# EAGLE design frontpanel (EAGLE 9.6.2)
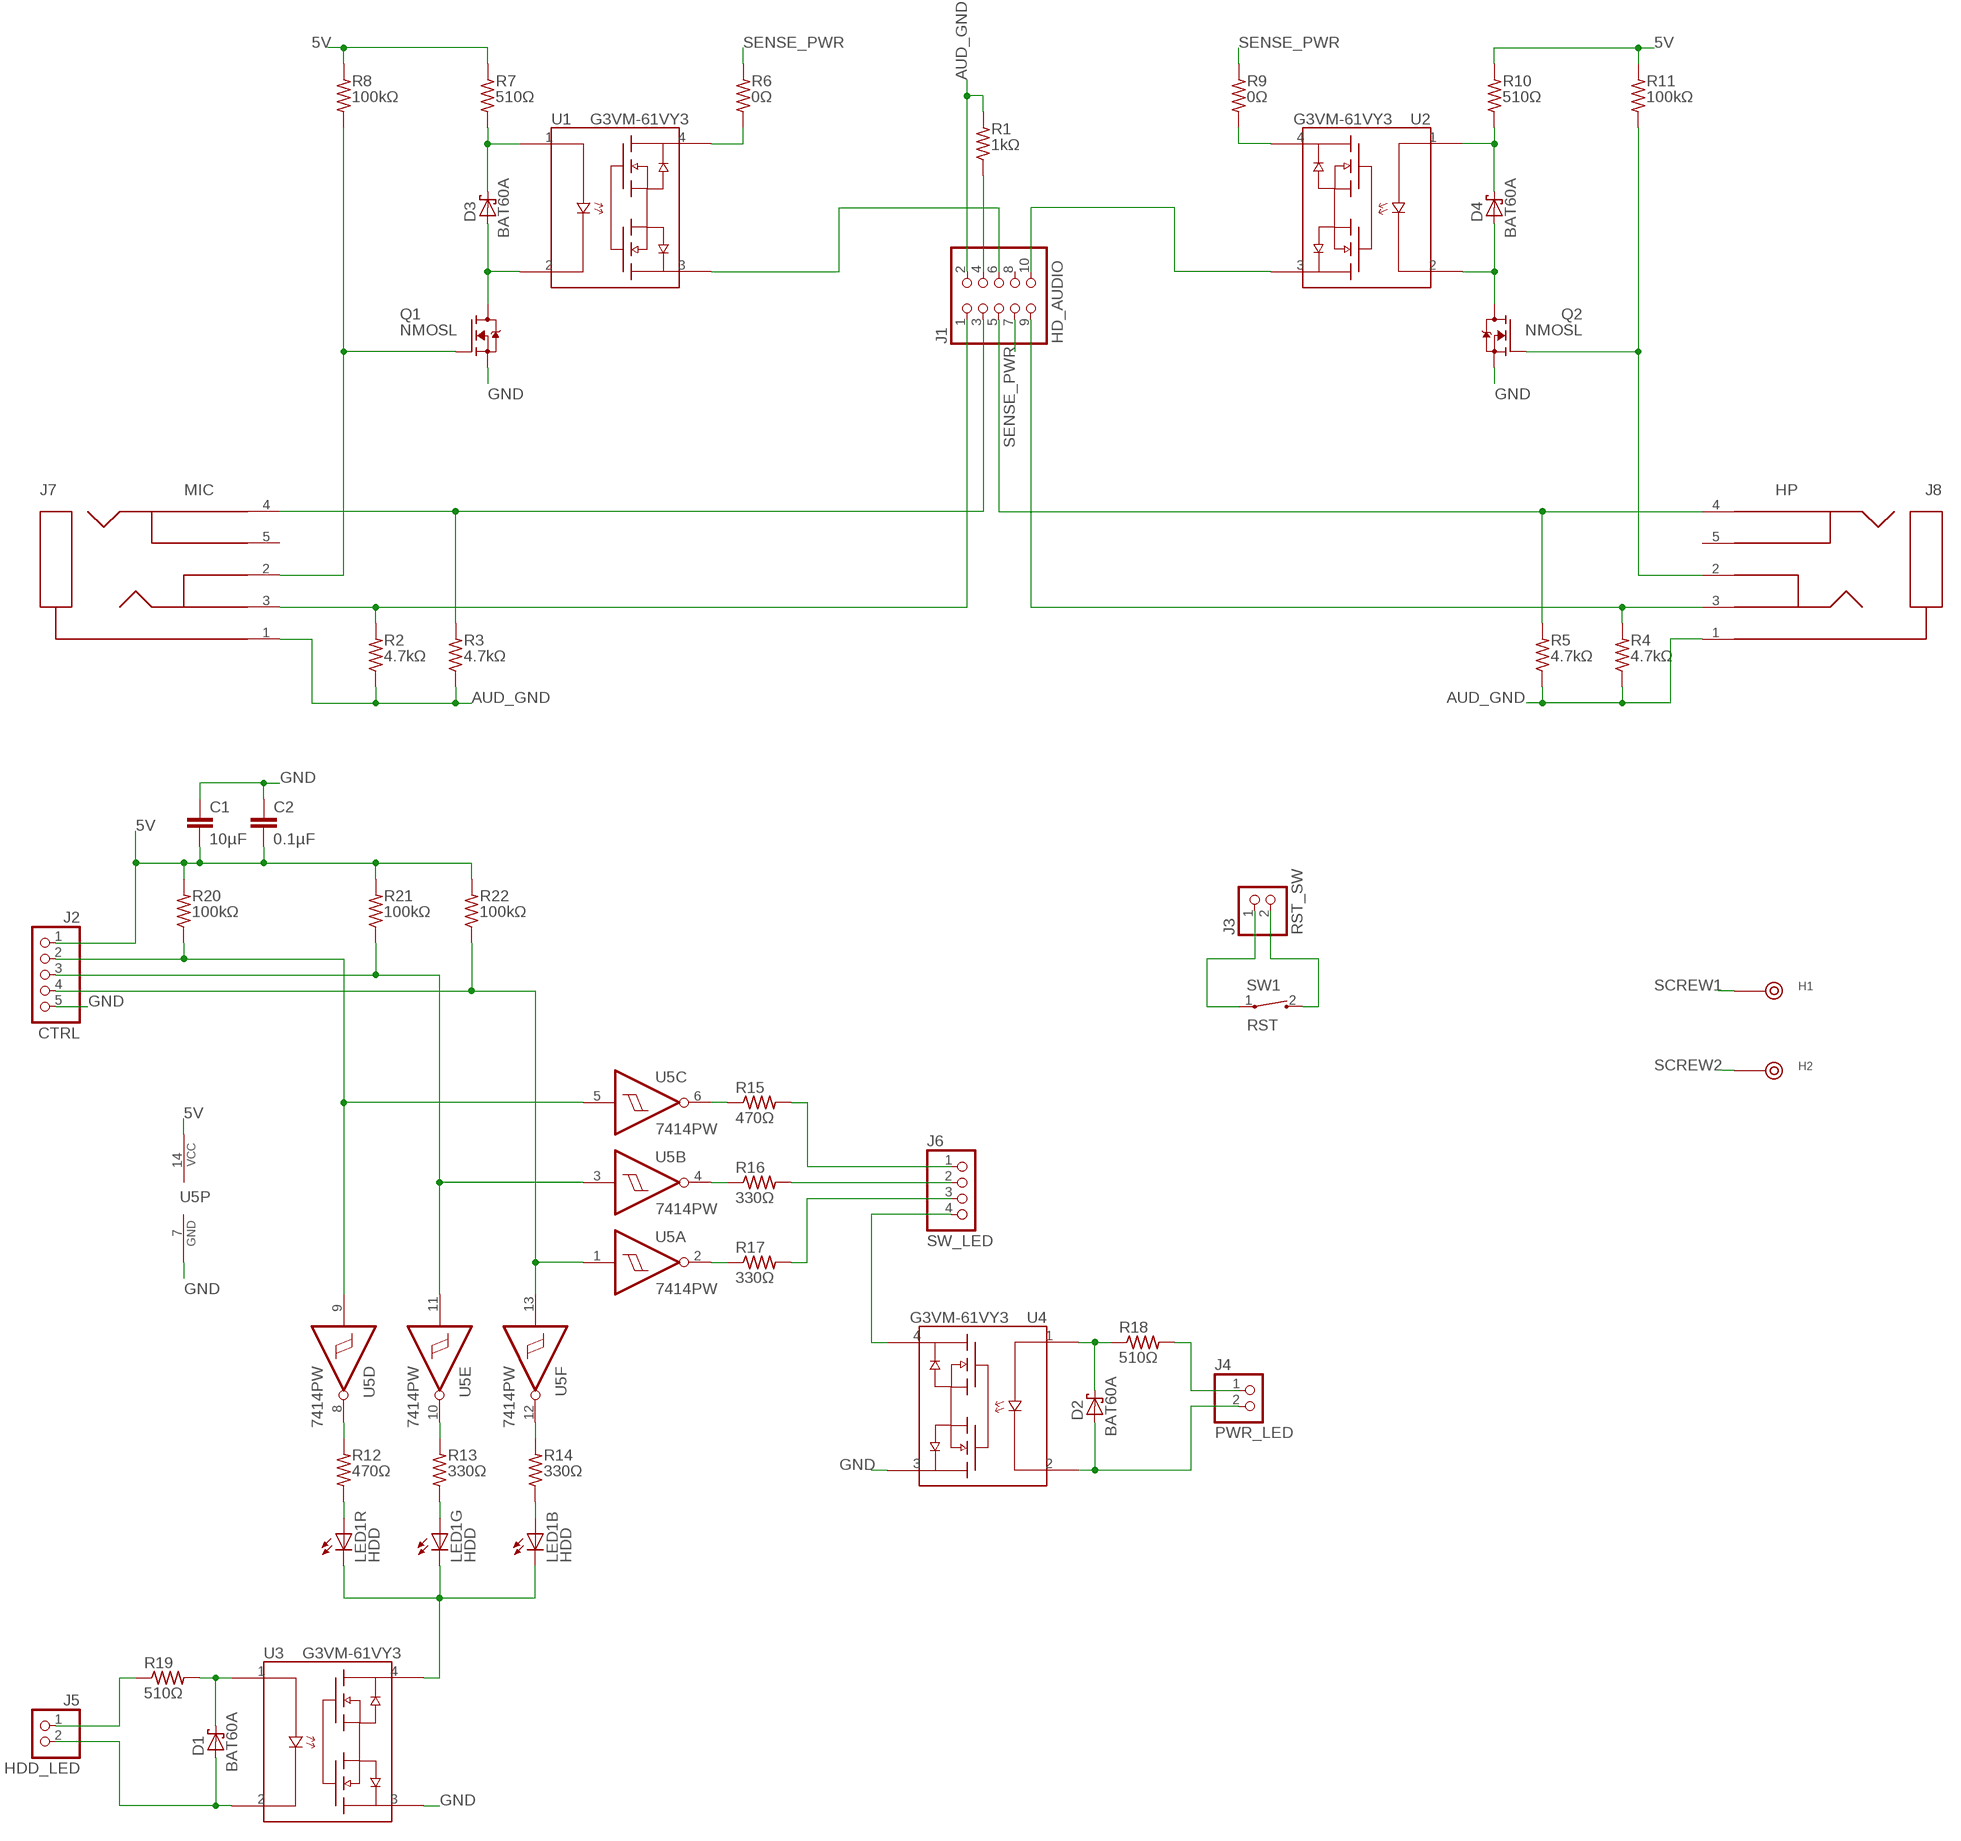
[diagram p0: schematic, sheet 1]

## Parts
C1  10µF  C-EUC0805  [C0805]
C2  0.1µF  C-EUC0603  [C0603]
D1  BAT60A  SOD323-SCHOTTKY  [SOD323]
D2  BAT60A  SOD323-SCHOTTKY  [SOD323]
D3  BAT60A  SOD323-SCHOTTKY  [SOD323]
D4  BAT60A  SOD323-SCHOTTKY  [SOD323]
H1  7466313R  [7466313R]
H2  7466313R  [7466313R]
J1  HD_AUDIO  PINHD-2X5  [2X05]
J2  CTRL  PINHD-1X5  [1X05]
J3  RST_SW  PINHD-1X2  [1X02]
J4  PWR_LED  PINHD-1X2  [1X02]
J5  HDD_LED  PINHD-1X2  [1X02]
J6  SW_LED  PINHD-1X4  [1X04]
J7  MIC  ACJS-MV35-5-  [ACJS-MV35-5]
J8  HP  ACJS-MV35-5-  [ACJS-MV35-5]
LED1  HDD  PLCC-6-RGBLED  [PLCC-6]
Q1  NMOSL  SOT23-N-MOSFET  [SOT23]
Q2  NMOSL  SOT23-N-MOSFET  [SOT23]
R1  1kΩ  R-US_R0603  [R0603]
R2  4.7kΩ  R-US_R0603  [R0603]
R3  4.7kΩ  R-US_R0603  [R0603]
R4  4.7kΩ  R-US_R0603  [R0603]
R5  4.7kΩ  R-US_R0603  [R0603]
R6  0Ω  R-US_R0603  [R0603]
R7  510Ω  R-US_R0603  [R0603]
R8  100kΩ  R-US_R0603  [R0603]
R9  0Ω  R-US_R0603  [R0603]
R10  510Ω  R-US_R0603  [R0603]
R11  100kΩ  R-US_R0603  [R0603]
R12  470Ω  R-US_R0603  [R0603]
R13  330Ω  R-US_R0603  [R0603]
R14  330Ω  R-US_R0603  [R0603]
R15  470Ω  R-US_R0603  [R0603]
R16  330Ω  R-US_R0603  [R0603]
R17  330Ω  R-US_R0603  [R0603]
R18  510Ω  R-US_R0603  [R0603]
R19  510Ω  R-US_R0603  [R0603]
R20  100kΩ  R-US_R0603  [R0603]
R21  100kΩ  R-US_R0603  [R0603]
R22  100kΩ  R-US_R0603  [R0603]
SW1  RST  TLS-A-070J-LFS  [TLS-*J-LFS]
U1  G3VM-61VY3  SOP-4-SSR  [SOP-4]
U2  G3VM-61VY3  SOP-4-SSR  [SOP-4]
U3  G3VM-61VY3  SOP-4-SSR  [SOP-4]
U4  G3VM-61VY3  SOP-4-SSR  [SOP-4]
U5  7414PW  [TSSOP14]

## Nets
5V: C1.2 C2.2 J2.1 R7.2 R8.2 R10.2 R11.2 R20.2 R21.2 R22.2 U5.14(P:VCC)
!PWM_B: J2.4 R22.1 U5.1(A:I) U5.13(F:I)
!PWM_G: J2.3 R21.1 U5.3(B:I) U5.11(E:I)
!PWM_R: J2.2 R20.1 U5.5(C:I) U5.9(D:I)
AUD_GND: J1.2 J7.1(S) J8.1(S) R1.2 R2.1 R3.1 R4.1 R5.1
GND: C1.1 C2.1 J2.5 Q1.2(S) Q2.2(S) U3.3 U4.3 U5.7(P:GND)
HDD_LED_B: LED1.5(B:A) R14.1
HDD_LED_B_RAW: R14.2 U5.12(F:O)
HDD_LED_DRIVE: D1.1(C) R19.2 U3.1(A)
HDD_LED_G: LED1.3(G:A) R13.1
HDD_LED_G_RAW: R13.2 U5.10(E:O)
HDD_LED_IN+: J5.1 R19.1
HDD_LED_IN-: D1.2(A) J5.2 U3.2(K)
HDD_LED_K: LED1.2(R:C) LED1.4(G:C) LED1.6(B:C) U3.4
HDD_LED_R: LED1.1(R:A) R12.1
HDD_LED_R_RAW: R12.2 U5.8(D:O)
HEADER_SENSE: J1.4 R1.1
HP_L: J1.9 J8.3(T) R4.2
HP_R: J1.5 J8.4(R) R5.2
HP_SENSE: J1.10 U2.3
HP_SENSE_PWR: R9.1 U2.4
HP_SENSEDR_A: D4.1(C) R10.1 U2.1(A)
HP_SENSEDR_K: D4.2(A) Q2.3(D) U2.2(K)
HP_TIPSW: J8.2(T-RETURN) Q2.1(G) R11.1
MIC_L: J1.1 J7.3(T) R2.2
MIC_R: J1.3 J7.4(R) R3.2
MIC_SENSE: J1.6 U1.3
MIC_SENSE_PWR: R6.1 U1.4
MIC_SENSEDR_A: D3.1(C) R7.1 U1.1(A)
MIC_SENSEDR_K: D3.2(A) Q1.3(D) U1.2(K)
MIC_TIPSW: J7.2(T-RETURN) Q1.1(G) R8.1
PWR_LED_IN+: J4.1 R18.2
PWR_LED_IN-: D2.2(A) J4.2 U4.2(K)
RST_SW_1: J3.1 SW1.1
RST_SW_2: J3.2 SW1.2
SCREW1: H1.H1 H1.H2 H1.P
SCREW2: H2.H1 H2.H2 H2.P
SENSE_PWR: J1.7 R6.2 R9.2
SW_LED_B: J6.3 R17.2
SW_LED_B_RAW: R17.1 U5.2(A:O)
SW_LED_DRIVE: D2.1(C) R18.1 U4.1(A)
SW_LED_G: J6.2 R16.2
SW_LED_G_RAW: R16.1 U5.4(B:O)
SW_LED_K: J6.4 U4.4
SW_LED_R: J6.1 R15.2
SW_LED_R_RAW: R15.1 U5.6(C:O)
Unconnected: J1.8 J7.5(R-RETURN) J8.5(R-RETURN)

## Library data of the parts
C1 C2 = rcl:C-EU: CAPACITOR, European symbol; SPICEPREFIX: C
D1-D4 = BW-Active:SOD323-SCHOTTKY
H1 H2 = BW-Connectors:7466313R: M3 screw terminal, right-angle
J1 = pinhead:PINHD-2X5: PIN HEADER
J2 = pinhead:PINHD-1X5: PIN HEADER
J3-J5 = pinhead:PINHD-1X2: PIN HEADER
J6 = pinhead:PINHD-1X4: PIN HEADER
J7 J8 = BW-Connectors:ACJS-*V35-5: Vertical 3.5mm audio jack
LED1 = BW-Active:PLCC-6-RGBLED: 3535 RGB LED Individual anodes/cathodes
Q1 Q2 = BW-Active:SOT23-N-MOSFET
R1-R22 = resistor:R-US_: RESISTOR, American symbol
SW1 = BW-PassiveMechanical:TLS-*J-LFS: Tactile microswitch, high activation force
U1-U4 = BW-Active:SOP-4-SSR: Solid-state relay
U5 = BW-Active:74*14: Hex Schmitt Trigger Inverter

## Board
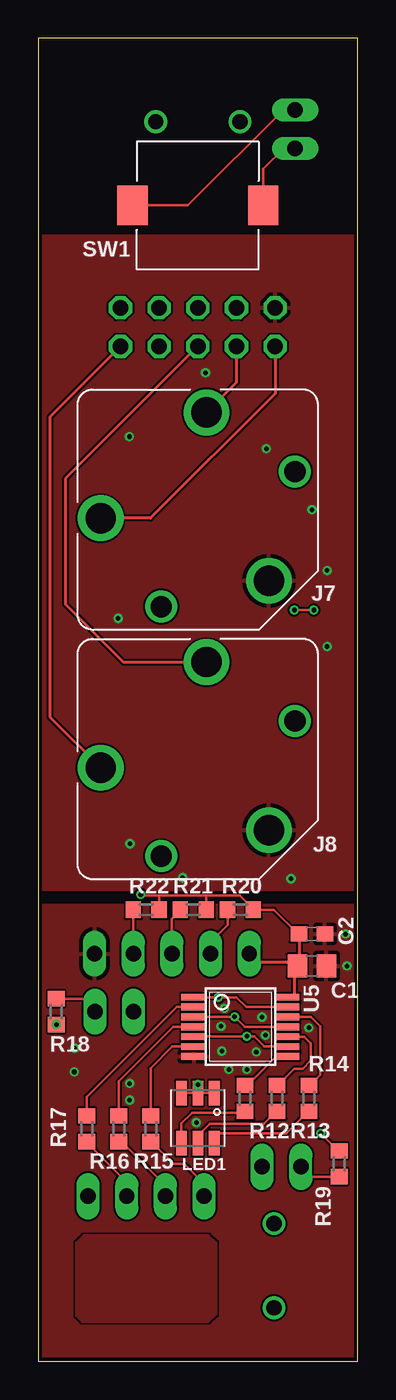
[diagram p1: board, top side]
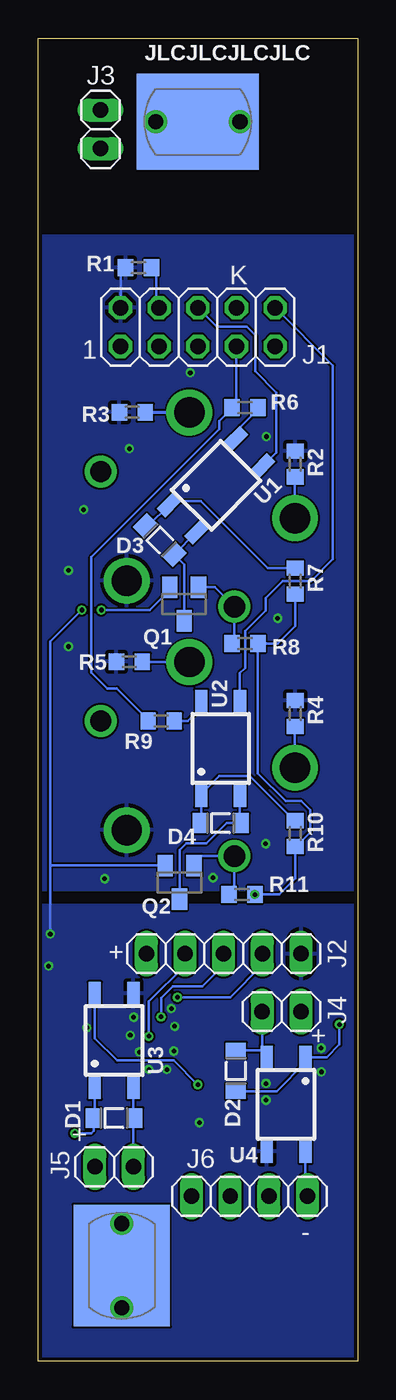
[diagram p2: board, bottom side, seen from below]

Size 21 x 87 mm. Coordinates in mm from the lower left corner, seen from the top.
Outline: 0,0 21,0 21,87 0,87 0,0
Copper layers (1*16): Top 0.035mm / dielectric 1.6mm / Bottom 0.035mm
Design rules "jlcpcb-2l": minimum track width 5mil, minimum drill 0.3mm, track to track 5mil, track to pad 5mil, pad to pad 5mil, via to via 5mil, smd to smd 0mil, copper to edge 0.25mm, drill to drill 0.5mm, minimum pad ring 0.15mm, minimum via ring 0.15mm, stop-mask expansion 4mil, vias tented up to drill 0.3mm, thermal gap 10mil
bKeepout: area 0,0 to 21,2; area 19,2 to 21,85; area 0,85 to 21,87; area 0,2 to 2,85

### Footprints (pad centres in the part's own frame; a part is rotated, then mirrored left to right if it is on the bottom)
C0805 = smd 1.3 x 1.5: 1 -0.95,0; 2 0.95,0
C0603 = smd 1.1 x 1: 1 -0.85,0; 2 0.85,0
SOD323 = smd 1 x 1.3: 1 -1.35,0; 2 1.35,0
7466313R = drill 1: H1 -2.77,0; H2 2.77,0 | smd 8 x 6.33: P 0,0
2X05 = drill 1.016 octagon: 1 -5.08,-1.27; 2 -5.08,1.27; 3 -2.54,-1.27; 4 -2.54,1.27; 5 0,-1.27; 6 0,1.27; 7 2.54,-1.27; 8 2.54,1.27; 9 5.08,-1.27; 10 5.08,1.27
1X05 = drill 1.016 long: 1 -5.08,0; 2 -2.54,0; 3 0,0; 4 2.54,0; 5 5.08,0
1X02 = drill 1.016 long: 1 -1.27,0; 2 1.27,0
1X04 = drill 1.016 long: 1 -3.81,0; 2 -1.27,0; 3 1.27,0; 4 3.81,0
ACJS-MV35-5 = drill 2: 1 4.67,-4.67; 3 -6.38,-0.56; 4 0.56,6.38 | drill 1.4: 2 -2.4,-6.38; 5 6.38,2.5
PLCC-6 = smd 1.6 x 0.7: 1 -1.65,1.08; 2 1.65,1.08; 3 -1.65,0; 4 1.65,0; 5 -1.65,-1.08; 6 1.65,-1.08
SOT23 = smd 1 x 1.4: 1 -0.95,-1.1; 2 0.95,-1.1; 3 0,1.1
R0603 = smd 1 x 1.1: 1 -0.85,0; 2 0.85,0
TLS-*J-LFS = smd 2 x 2.6: 1 -4.3,0; 2 4.3,0
SOP-4 = smd 0.8 x 1.5: 1 -1.27,-3.1; 2 1.27,-3.1; 3 1.27,3.1; 4 -1.27,3.1
TSSOP14 = smd 0.45 x 1.65: 1 -1.95,-3.05; 2 -1.3,-3.05; 3 -0.65,-3.05; 4 0,-3.05; 5 0.65,-3.05; 6 1.3,-3.05; 7 1.95,-3.05; 8 1.95,3.05; 9 1.3,3.05; 10 0.65,3.05; 11 0,3.05; 12 -0.65,3.05; 13 -1.3,3.05; 14 -1.95,3.05

### Placement (x,y rotation side)
C1  18,26 180 top
C2  18,28.1 180 top
D1  16,16 0 bottom
D2  8,19.1 90 bottom
D3  13,54 315 bottom
D4  9,35.4 0 bottom
H1  10.5,81.5 0 bottom
H2  15.5,6.3 270 bottom
J1  10.5,68 0 bottom
J2  8.8,26.8 0 bottom
J3  16.9,81 270 bottom
J4  5,23 180 bottom
J5  16,12.8 0 bottom
J6  7.1,10.86 0 bottom
J7  10.5,56 0 top
J8  10.5,39.6 0 top
LED1  10.5,16 90 top
Q1  11.4,49.8 180 bottom
Q2  11.7,31.5 180 bottom
R1  14.4,71.9 180 bottom
R2  4.1,59 270 bottom
R3  14.8,62.4 0 bottom
R4  4.1,42.6 270 bottom
R5  15,46 0 bottom
R6  7.4,62.7 180 bottom
R7  4.1,51.3 270 bottom
R8  7.4,47.2 0 bottom
R9  12.9,42.1 180 bottom
R10  4.1,34.7 270 bottom
R11  7.6,30.7 0 bottom
R12  13.6,17.3 90 top
R13  15.7,17.3 90 top
R14  17.8,17.3 90 top
R15  7.4,15.3 270 top
R16  5.3,15.3 270 top
R17  3.2,15.3 270 top
R18  1.2,23 90 top
R19  19.8,13 90 top
R20  13.3,29.7 0 top
R21  10.2,29.7 0 top
R22  7.1,29.7 0 top
SW1  10.5,76 0 top
U1  9.3,57.6 315 bottom
U2  9,40.3 0 bottom
U3  16,21.1 0 bottom
U4  4.7,16.9 180 bottom
U5  13.3,22 270 top

### Tracks (layer width: path | path; a pad name or v marks a point on that pad's centre or on a via)
5V  (via drill 0.3)
  Top 0.152: C2.2 17.1,28.1 15.5,29.7 R20.2 14.15,29.75 13.26,30.64 11.04,30.64 | R21.2 11.05,30.63 11.04,30.64 | R11.2 6.81,30.64 7.96,30.64 | 7.96,30.64 11.04,30.64 | R22.2 7.95,30.63 7.96,30.64
  Top 0.2: C1.2 16.83,25.78 16.83,24.05 16.73,23.95 U5.14
  Top 0.203: J2.1 14.42,26.26 16.79,26.26 C1.2 17.15,26.1 C2.2
  Bottom 0.152: R11.2 5.14,30.7 4.1,31.74 R10.2 4.05,33.85 3.12,34.78 3.12,36.24 3.72,36.84 4.72,36.84 6.55,38.67 R8.2 5.26,47.2 4.1,48.36 R7.2
  other vias: 6.75,30.7
!PWM_B  (via drill 0.3)
  Top 0.152: R22.1 J2.4 | U5.1 v11.84,23.94 13.04,23.94 13.68,23.3 U5.13
  Bottom 0.152: J2.4 6.26,26.06 8.38,23.94 v11.84,23.94
!PWM_G  (via drill 0.3)
  Top 0.152: J2.3 8.8,29.1 9.35,29.65 R21.1 | U5.3 v12.92,22.66 13.58,22 U5.11
  Bottom 0.152: J2.3 8.8,26.06 10.2,24.66 12.16,24.66 12.92,23.9 v12.92,22.66
!PWM_R  (via drill 0.3)
  Top 0.152: J2.2 11.34,27.58 12.45,28.69 R20.1 | U5.5 10.28,21.38 v13.72,21.38 14.2,21.38 14.88,20.7 U5.9
  Bottom 0.152: J2.2 11.34,26.04 13.72,23.66 v13.72,21.38
AUD_GND  (via drill 0.3)
  Bottom 0.152: R1.2 15.58,71.57 J1.2
  other vias: 15,60 18,56 19,52 19,47 11,65 6,60.8 9.5,31.8 5.26,48.86 6.04,34.04 16.62,31.74
  pour Top (rank 6): -1,31 22,31 22,74 -1,74
  pour Bottom (rank 6): -1,31 22,31 22,74 -1,74
GND  (via drill 0.3)
  Top 0.152: v18.12,49.4 v16.84,49.4
  Bottom 0.152: v20.2,28.1 20.2,32.6 | Q2.2 20.2,32.6 | 20.2,32.6 20.2,47.32 v18.12,49.4 | v16.84,49.4 13.66,49.4 12.35,50.71 Q1.2
  other vias: 2.4,20.6 20.3,26 12.08,20.4 14.34,20.34 13.72,19.2 10.4,15.7 2.38,19.04 6.02,18.28 6.02,17.18 12.54,19.2 12.02,22.04 14.72,22.64 14.94,21.44 12.24,23.2 17.8,21.94
  pour Bottom (rank 6): -1,30 22,30 22,0 21,-1 0,-1 -1,0
  pour Top (rank 6): -1,30 -1,0 0,-1 21,-1 22,0 22,30
HDD_LED_B
  Top 0.152: R14.1 17.75,16.45 16.3,15 11.7,15 11.58,14.88 LED1.5
HDD_LED_B_RAW
  Top 0.152: U5.12 17.93,22.65 18.54,22.04 18.54,18.83 17.86,18.15 R14.2
HDD_LED_DRIVE  (via drill 0.3)
  Top 0.152: R19.2 19.73,13.85 v18.58,15
  Bottom 0.152: v18.58,15 17.5,15 17.35,15.15 D1.1 17.27,16.08 U3.1
HDD_LED_G
  Top 0.152: R13.1 15.65,16.45 14.82,15.62 11.28,15.62 10.5,14.84 LED1.3
HDD_LED_G_RAW
  Top 0.152: U5.10 17.49,21.35 17.92,20.92 17.92,19.78 17.38,19.24 16.84,19.24 15.75,18.15 R13.2
HDD_LED_IN+
  Top 0.152: J5.1 17.27,12.68 17.8,12.15 R19.1
HDD_LED_IN-
  Bottom 0.152: J5.2 14.73,15.92 D1.2 14.73,16.08 U3.2
HDD_LED_K  (via drill 0.3)
  Top 0.152: LED1.2 LED1.4 | LED1.4 LED1.6 | LED1.4 v10.5,18.2
  Bottom 0.152: v10.5,18.2 12.08,19.78 15.8,19.78 17.27,21.25 U3.4
HDD_LED_R
  Top 0.152: R12.1 13.5,16.35 10.13,16.35 9.42,15.64 LED1.1
HDD_LED_R_RAW
  Top 0.152: U5.8 15.65,20.05 13.75,18.15 R12.2
HEADER_SENSE
  Bottom 0.152: R1.1 13.22,71.57 13.22,69.45 J1.4
HP_L
  Top 0.203: J1.9 0.78,62.09 0.78,42.38 J8.3
  Bottom 0.152: J8.3 4.12,41.73 R4.2
HP_R
  Top 0.203: J1.5 1.8,58.03 1.8,49.78 5.6,45.98 J8.4
  Bottom 0.152: J8.4 14.13,45.98 R5.2
HP_SENSE
  Bottom 0.152: U2.3 7.73,45.25 7.4,45.58 7.4,48.02 6.04,49.38 6.04,50.2 4.92,51.32 3.04,51.32 1.62,52.74 1.62,65.47 J1.10
HP_SENSE_PWR
  Bottom 0.152: U2.4 10.27,42.98 11.15,42.1 R9.1
HP_SENSEDR_A
  Bottom 0.152: R10.1 4.15,35.55 7.08,38.48 9.1,38.48 10.27,37.31 10.27,37.26 U2.1 10.27,35.48 D4.1
HP_SENSEDR_K
  Bottom 0.152: Q2.3 11.7,33.62 11.26,34.06 9.94,34.06 8.6,35.4 D4.2 7.73,35.48 U2.2
HP_TIPSW
  Bottom 0.152: Q2.1 10.75,32.98 10.51,33.22 J8.2 8.1,31.05 R11.1
LOGO
  pour Top: 2.5,7.8 3,8.3 11.2,8.3 11.7,7.8 11.7,3.1 11.2,2.6 2.9,2.6 2.5,3
MIC_L
  Top 0.203: J1.1 15.58,63.64 7.38,55.44 J7.3
  Bottom 0.152: J7.3 4.12,58.13 R2.2
MIC_R
  Top 0.203: J1.3 13.04,64.36 J7.4
  Bottom 0.203: J7.4 13.93,62.38 R3.2
MIC_SENSE
  Bottom 0.152: J1.6 9.25,68.02 7.3,68.02 6.74,67.46 6.74,65.1 5.34,63.7 5.34,59.76 U1.3
MIC_SENSE_PWR
  Bottom 0.152: R6.1 6.55,62.57 8.01,61.11 U1.4
MIC_SENSEDR_A
  Bottom 0.152: D3.1 13.74,54.95 U1.1 12.14,56.56 10.3,56.56 5.89,52.15 R7.1
MIC_SENSEDR_K
  Bottom 0.152: Q1.3 11.4,52.4 D3.2 U1.2
MIC_TIPSW
  Bottom 0.152: Q1.1 9.38,50.9 J7.2 8.1,47.35 R8.1
PWR_LED_IN+
  Top 0.152: J4.1 3.73,23.4 3.28,23.85 R18.2
PWR_LED_IN-
  Bottom 0.152: U4.2 6.27,20.31 6.27,20.44 | 6.27,20.44 J4.2 | D2.2 6.28,20.45 6.27,20.44
RST_SW_1
  Top 0.152: J3.1 16.11,82.27 9.84,76 SW1.1
RST_SW_2
  Top 0.152: J3.2 16.13,79.73 14.8,78.4 SW1.2
SENSE_PWR
  Bottom 0.152: 8.22,62.66 9.08,61.81 9.08,61.3 17.5,52.88 17.5,45.28 16.46,44.24 15.82,44.24 13.75,42.17 R9.2 | 8.22,62.66 7.96,62.93 J1.7 | R6.2 8.22,62.66
SW_LED_B
  Top 0.152: R17.2 3.2,14.4 5.83,11.77 J6.3
SW_LED_B_RAW
  Top 0.152: U5.2 9.1,23.3 3.2,17.4 R17.1
SW_LED_DRIVE  (via drill 0.3)
  Bottom 0.152: R18.1 1.2,20.84 2.04,20 U4.1 3.43,19.65 5.33,17.75 D2.1
  other vias: 1.2,22.15
SW_LED_G
  Top 0.152: R16.2 5.49,14.45 8.37,11.57 J6.2
SW_LED_G_RAW
  Top 0.152: U5.4 8.9,22 5.3,18.4 R16.1
SW_LED_K
  Bottom 0.152: U4.4 3.43,11 J6.4
SW_LED_R
  Top 0.152: R15.2 7.45,14.45 8.92,12.98 9.6,12.98 10.91,11.67 J6.1
SW_LED_R_RAW
  Top 0.152: U5.6 8.82,20.7 7.4,19.28 R15.1

### Text on the board
bPlace: JLCJLCJLCJLC | K | 1 | + | + | + | -